# EAGLE design M_J_ext_e_ink_disp-inv (EAGLE 9.6.2)
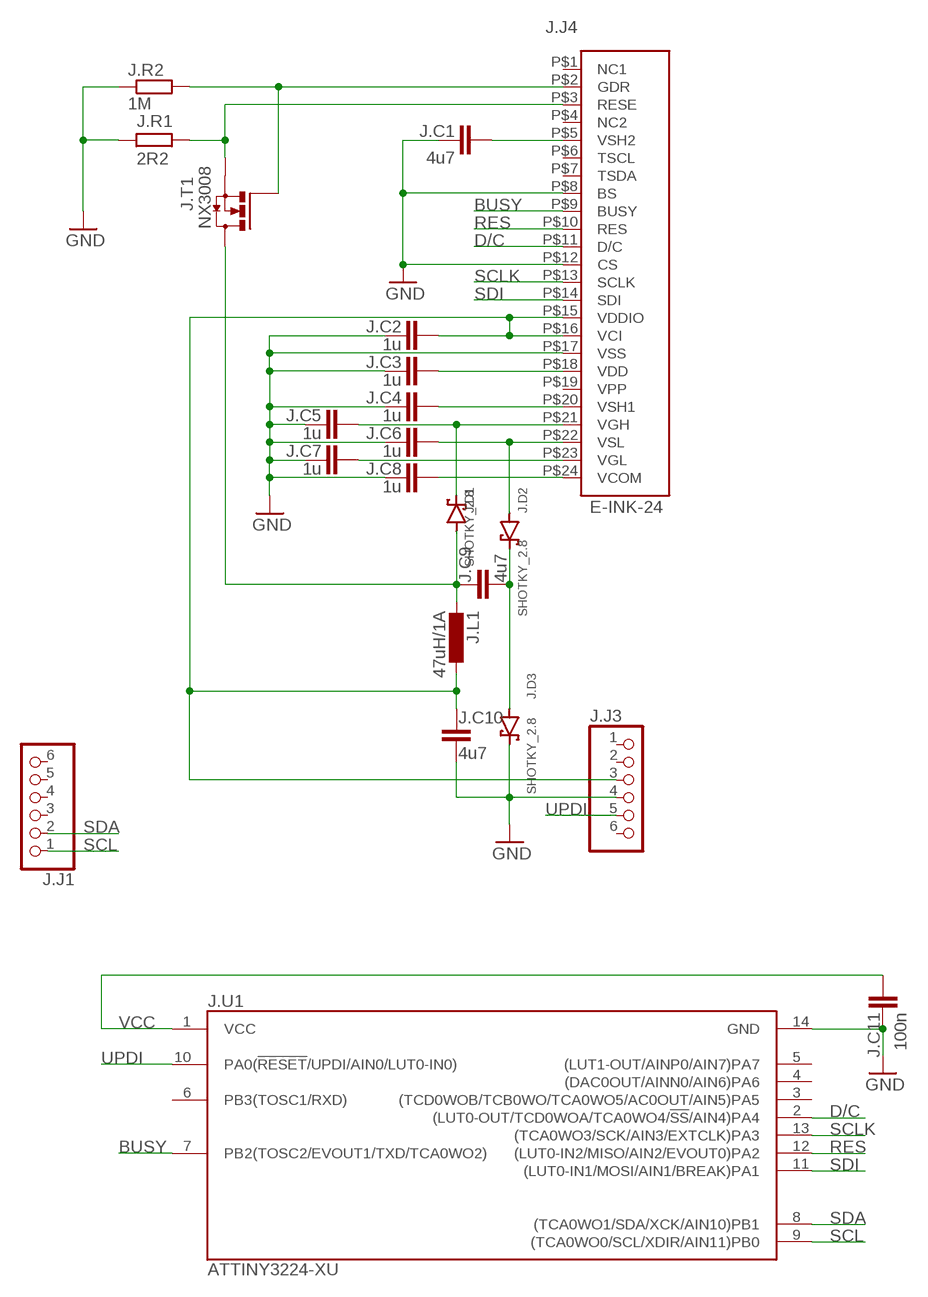
[diagram p0: schematic, sheet 1]

## Parts
J.C1  4u7  C-EUC0603  [C0603]
J.C2  1u  C-EUC0603  [C0603]
J.C3  1u  C-EUC0603  [C0603]
J.C4  1u  C-EUC0603  [C0603]
J.C5  1u  C-EUC0603  [C0603]
J.C6  1u  C-EUC0603  [C0603]
J.C7  1u  C-EUC0603  [C0603]
J.C8  1u  C-EUC0603  [C0603]
J.C9  4u7  C-EUC0603  [C0603]
J.C10  4u7  C-EUC0603  [C0603]
J.C11  100n  C-EUC0603  [C0603]
J.D1  SHOTKY_2.8  [SHOTKY_2.8]
J.D2  SHOTKY_2.8  [SHOTKY_2.8]
J.D3  SHOTKY_2.8  [SHOTKY_2.8]
J.J1  PINHD-1X6  [1X06]
J.J3  PINHD-1X6  [1X06]
J.J4  E-INK-24  [E-INK-24]
J.L1  47uH/1A  L-EUL3230M  [L3230M]
J.R1  2R2  R-EU_R0603  [R0603]
J.R2  1M  R-EU_R0603  [R0603]
J.T1  NX3008  N-MOSFET  [SO23]
J.U1  ATTINY3224-XU  [TSSOP14]

## Nets
BUSY: J.J4.P$9(BUSY) J.U1.7(PB2(TOSC2/EVOUT1/TXD/TCA0WO2))
D/C: J.J4.P$11(D/C) J.U1.2((LUT0-OUT/TCD0WOA/TCA0WO4/!SS!/AIN4)PA4)
GND: J.C1.2 J.C2.2 J.C3.2 J.C4.2 J.C5.2 J.C6.2 J.C7.2 J.C8.2 J.C10.2 J.C11.2 J.D3.K(C) J.J3.4 J.J4.P$8(BS) J.J4.P$12(CS) J.J4.P$17(VSS) J.R1.2 J.R2.1 J.U1.14(GND)
N$1: J.C1.1 J.J4.P$5(VSH2)
N$2: J.C8.1 J.J4.P$24(VCOM)
N$3: J.C6.1 J.D2.A J.J4.P$22(VSL)
N$4: J.C5.1 J.D1.K(C) J.J4.P$21(VGH)
N$5: J.C9.2 J.D2.K(C) J.D3.A
N$6: J.J4.P$3(RESE) J.R1.1 J.T1.S
N$7: J.C3.1 J.J4.P$18(VDD)
N$8: J.C4.1 J.J4.P$20(VSH1)
N$10: J.C9.1 J.D1.A J.L1.2 J.T1.D
N$11: J.C7.1 J.J4.P$23(VGL)
N$13: J.J4.P$2(GDR) J.R2.2 J.T1.G
RES: J.J4.P$10(RES) J.U1.12((LUT0-IN2/MISO/AIN2/EVOUT0)PA2)
SCL: J.J1.1 J.U1.9((TCA0WO0/SCL/XDIR/AIN11)PB0)
SCLK: J.J4.P$13(SCLK) J.U1.13((TCA0WO3/SCK/AIN3/EXTCLK)PA3)
SDA: J.J1.2 J.U1.8((TCA0WO1/SDA/XCK/AIN10)PB1)
SDI: J.J4.P$14(SDI) J.U1.11((LUT0-IN1/MOSI/AIN1/BREAK)PA1)
UPDI: J.J3.5 J.U1.10(PA0(!RESET!/UPDI/AIN0/LUT0-IN0))
VCC: J.C2.1 J.C10.1 J.C11.1 J.J3.3 J.J4.P$15(VDDIO) J.J4.P$16(VCI) J.L1.1 J.U1.1(VCC)
Unconnected: J.J1.3 J.J1.4 J.J1.5 J.J1.6 J.J3.1 J.J3.2 J.J3.6 J.J4.P$1(NC1) J.J4.P$4(NC2) J.J4.P$6(TSCL) J.J4.P$7(TSDA) J.J4.P$19(VPP) J.U1.3((TCD0WOB/TCB0WO/TCA0WO5/AC0OUT/AIN5)PA5) J.U1.4((DAC0OUT/AINN0/AIN6)PA6) J.U1.5((LUT1-OUT/AINP0/AIN7)PA7) J.U1.6(PB3(TOSC1/RXD))

## Library data of the parts
J.C1-J.C11 = rcl:C-EU: CAPACITOR, European symbol; SPICEPREFIX: C
J.D1-J.D3 = hugo:SHOTKY_2.8
J.J1 J.J3 = pinhead2:PINHD-1X6: PIN HEADER
J.J4 = hugo:E-INK-24
J.L1 = rcl:L-EU: INDUCTOR, European symbol; SPICEPREFIX: L
J.R1 = resistor:R-EU_: RESISTOR, European symbol
J.R2 = rcl:R-EU_: RESISTOR, European symbol; SPICEPREFIX: R
J.T1 = hugo:N-MOSFET
J.U1 = ATTINY412-SSN:ATTINY3224-XU

## Board
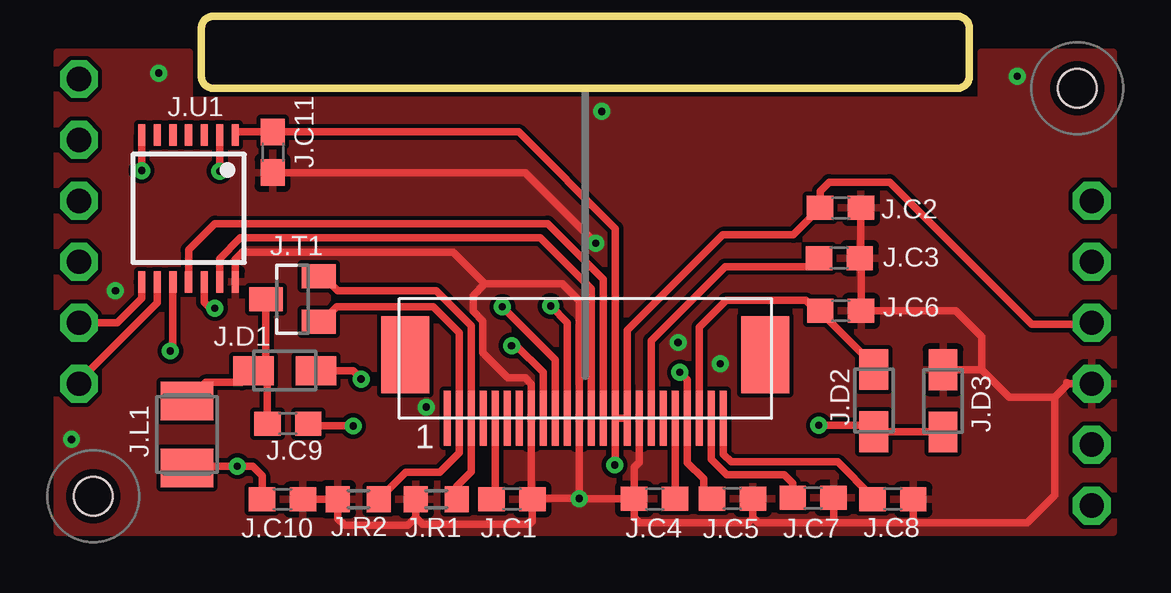
[diagram p1: board, top side]
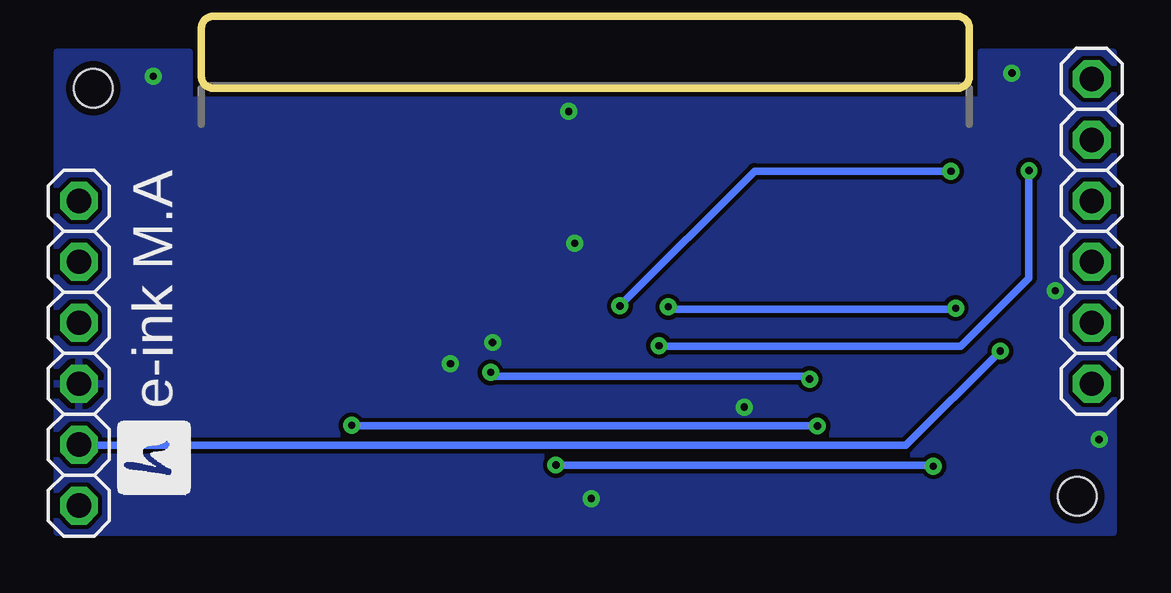
[diagram p2: board, bottom side, seen from below]

No outline drawn. Coordinates in mm, seen from the top.
Copper layers (1*16): Top 0.035mm / dielectric 1.5mm / Bottom 0.035mm
Design rules "default *": minimum track width 10mil, minimum drill 0.3mm, track to track 7mil, track to pad 7mil, pad to pad 7mil, via to via 10mil, smd to smd 10mil, copper to edge 10mil, drill to drill 15mil, minimum pad ring 10mil, minimum via ring 8mil, stop-mask expansion 4mil, vias tented up to drill 0mil, thermal gap 10mil
Holes 1.6 mm at 2,2 43,19
tRestrict: area 1,1 to 3,3; area 42,18 to 44,20
bRestrict: area 42,18 to 44,20; area 1,1 to 3,3
Milling: 8 lines

### Footprints (pad centres in the part's own frame; a part is rotated, then mirrored left to right if it is on the bottom)
C0603 = smd 1.1 x 1: 1 -0.85,0; 2 0.85,0
SHOTKY_2.8 = smd 1.7 x 1.2: A -1.3,0; K 1.3,0
1X06 = drill 1.016 pad 1.575 octagon: 1 -6.35,0; 2 -3.81,0; 3 -1.27,0; 4 1.27,0; 5 3.81,0; 6 6.35,0
E-INK-24 = smd 0.3 x 2.3: P$1 5.75,2.75; P$2 5.25,2.75; P$3 4.75,2.75; P$4 4.25,2.75; P$5 3.75,2.75; P$6 3.25,2.75; P$7 2.75,2.75; P$8 2.25,2.75; P$9 1.75,2.75; P$10 1.25,2.75; P$11 0.75,2.75; P$12 0.25,2.75; P$13 -0.25,2.75; P$14 -0.75,2.75; P$15 -1.25,2.75; P$16 -1.75,2.75; P$17 -2.25,2.75; P$18 -2.75,2.75; P$19 -3.25,2.75; P$20 -3.75,2.75; P$21 -4.25,2.75; P$22 -4.75,2.75; P$23 -5.25,2.75; P$24 -5.75,2.75 | smd 2 x 3.2: P$25 -7.5,0.1; P$26 7.5,0.1
L3230M = smd 1.6 x 2.2: 1 -1.4,0; 2 1.4,0
R0603 = smd 1 x 1.1: 1 -0.85,0; 2 0.85,0
SO23 = smd 1 x 1.4: D 0,1.1; G -0.95,-1.1; S 0.95,-1.1
TSSOP14 = smd 0.3 x 0.9: 1 -1.95,-3.06; 2 -1.3,-3.06; 3 -0.65,-3.06; 4 0,-3.06; 5 0.65,-3.06; 6 1.3,-3.06; 7 1.95,-3.06; 8 1.95,3.06; 9 1.3,3.06; 10 0.65,3.06; 11 0,3.06; 12 -0.65,3.06; 13 -1.3,3.06; 14 -1.95,3.06

### Placement (x,y rotation side)
J.C1  19.45,1.87 0 top
J.C2  33.14,14.01 0 top
J.C3  33.09,11.92 0 top
J.C4  25.39,1.89 180 top
J.C5  28.63,1.9 0 top
J.C6  33.14,9.72 0 top
J.C7  32,1.93 0 top
J.C8  35.32,1.87 0 top
J.C9  10.11,5.02 0 top
J.C10  9.88,1.87 0 top
J.C11  9.47,16.33 270 top
J.D1  9.98,7.23 0 top
J.D2  34.52,5.98 270 top
J.D3  37.41,5.97 90 top
J.J1  1.4,13.04 90 bottom
J.J3  43.6,7.96 270 bottom
J.J4  22.5,8 180 top
J.L1  5.9,4.58 90 top
J.R1  16.29,1.87 180 top
J.R2  13.05,1.87 0 top
J.T1  10.29,10.21 90 top
J.U1  5.97,14 180 top

### Tracks (layer width: path | path; a pad name or v marks a point on that pad's centre or on a via)
BUSY  (via drill 0.3)
  Top 0.305: J.J4.P$9 20.75,7.16 19.63,8.28 v19.43,8.28 | v4.01,15.57 v4.02,15.58 J.U1.7
  Bottom 0.305: v19.43,8.28 19.4,8.28 19.38,8.25 6.86,8.25 4.01,11.09 v4.01,15.57
D/C  (via drill 0.3)
  Top 0.305: J.J4.P$11 21.75,9.24 v21.06,9.93 | v7.26,15.54 v7.27,15.55 J.U1.2
  Bottom 0.305: v21.06,9.93 15.44,15.54 v7.26,15.54
GND  (via drill 0.3)
  Top 0.305: J.J4.P$17 24.74,3.42 24.54,3.21 J.C4.2 | 42.06,6.12 42.06,2.03 40.92,0.89 36.2,0.89 | 42.06,6.12 42.62,6.68 | 42.62,6.68 42.63,6.69 J.J3.4 | J.U1.14 7.92,11.88 8.2,12.17 16.99,12.17 18.31,10.85 | 18.31,10.85 17.83,10.36 17.83,9.7 18.23,9.3 18.23,7.98 19.28,6.93 19.99,6.93 20.25,6.67 J.J4.P$8 20.25,1.92 | 18.31,10.85 21.55,10.85 22.25,10.14 J.J4.P$12 22.25,2.13 | J.C11.2 20,15.48 v22.94,12.55 | J.C10.2 J.R2.1 12.2,1.06 12.47,0.79 15.11,0.79 15.44,1.12 | 20.25,1.92 J.C1.2 20.3,0.97 20.17,0.84 15.72,0.84 15.44,1.12 | J.R1.2 15.44,1.12 | J.C4.2 22.49,1.89 22.25,2.13 | J.C5.2 29.48,1.12 | 29.48,1.12 29.48,1.08 29.29,0.89 24.77,0.89 24.54,1.12 J.C4.2 | 29.48,1.12 29.71,0.89 32.84,0.89 | 36.2,0.89 32.84,0.89 | J.C7.2 32.84,0.89 | J.C8.2 36.17,0.92 36.2,0.89 | 42.56,6.73 42.57,6.73 42.62,6.68 | 39.01,7.26 39.01,8.64 37.93,9.72 J.C6.2 33.99,11.87 J.C3.2 33.99,11.97 J.C2.2 | 39.01,7.26 40.16,6.12 42.06,6.12 | J.D3.K 39.01,7.26 | 22.25,2.13 22.04,1.92 20.25,1.92 | 22.25,2.13 v22.25,1.91 | v22.25,1.91
  other vias: 40.5,19.5 4.72,19.63 2.92,10.57 1.09,4.37 28.12,7.52 23.19,18.03 26.37,8.41 15.88,5.71
  pour Top: 44.5,20.5 39,20.5 39,18.5 6,18.5 6,20.5 0.5,20.5 0.5,0.5 44.5,0.5
  pour Bottom: 44.5,20.5 39,20.5 39,18.5 6,18.5 6,20.5 0.5,20.5 0.5,0.5 44.5,0.5
N$1
  Top 0.305: J.J4.P$5 18.75,2.03 J.C1.1
N$2
  Top 0.305: J.J4.P$24 28.25,3.75 28.57,3.43 33.01,3.43 34.47,1.98 J.C8.1
N$3
  Top 0.305: J.J4.P$22 27.25,9.04 28.37,10.16 31.69,10.16 32.14,9.72 J.C6.1 32.28,9.71 34.52,7.46 J.D2.A
N$4  (via drill 0.3)
  Top 0.305: v26.44,7.16 26.75,6.85 J.J4.P$21 26.75,3.4 27.43,2.72 27.43,2.25 J.C5.1 | J.D1.K 12.83,7.23 13.16,6.9 v13.16,6.88
  Bottom 0.305: v26.44,7.16 26.44,7.11 26.33,7 13.27,7 v13.16,6.88
N$5  (via drill 0.3)
  Top 0.305: 32.31,4.95 v32.23,4.95 34.25,4.95 J.D2.K 37.4,4.68 J.D3.A | v12.83,4.93 12.81,4.95 11.03,4.95 J.C9.2
  Bottom 0.305: v32.23,4.95 32.21,4.93 v12.83,4.93
N$6
  Top 0.305: J.T1.S 11.57,11.16 12.18,10.55 16.3,10.55 17.75,9.1 J.J4.P$3 17.76,3.02 17.14,2.41 J.R1.1
N$7
  Top 0.305: J.J4.P$18 25.25,8.48 28.33,11.56 31.88,11.56 J.C3.1
N$8
  Top 0.305: J.C4.1 26.25,1.9 J.J4.P$20
N$10
  Top 0.305: 5.87,6.11 J.L1.2 6.68,6.75 8.19,6.75 J.D1.A | J.D1.A 9.26,6.81 J.C9.1 | J.D1.A 9.19,7.23 J.T1.D
N$11
  Top 0.305: J.J4.P$23 27.74,3.54 28.39,2.9 30.79,2.9 31.14,2.54 J.C7.1
N$13
  Top 0.305: J.T1.G 11.5,9.26 12.14,9.91 16.15,9.91 17.25,8.81 J.J4.P$2 17.26,3.82 16.43,3 15.02,3 J.R2.2
RES  (via drill 0.3)
  Top 0.305: v19.04,9.89 21.25,7.68 J.J4.P$10 | J.U1.12 6.62,10.08 6.86,9.84 v7.07,9.84
  Bottom 0.305: v7.07,9.84 7.11,9.79 18.94,9.79 v19.04,9.89
SCL
  Top 0.305: J.J1.1 1.4,6.79 4.67,10.06 J.U1.9
SCLK
  Top 0.305: J.J4.P$13 22.75,10.65 20.62,12.78 8.13,12.78 7.26,11.9 J.U1.13
SDA
  Top 0.305: J.U1.8 4.01,10.93 4.01,10.24 3,9.23 J.J1.2
SDI
  Top 0.305: J.J4.P$14 23.25,11.04 20.93,13.36 7.06,13.36 5.97,12.27 J.U1.11
UPDI  (via drill 0.3)
  Top 0.305: v5.21,8.05 5.32,8.16 J.U1.10
  Bottom 0.305: J.J3.5 43.57,4.12 9.14,4.12 v5.21,8.05
VCC  (via drill 0.3)
  Top 0.305: J.J4.P$15 J.J4.P$16 24.25,8.91 28.24,12.89 31.17,12.89 J.C2.1 32.29,14.71 32.66,15.09 35.18,15.09 41.1,9.17 43.54,9.17 J.J3.3 | J.J4.P$15 23.75,3.33 v23.72,3.3 | J.L1.1 5.92,3.16 | J.L1.1 6.29,2.8 | J.L1.1 6.04,3.04 | 6.13,3.18 J.L1.1 | 9.05,1.99 J.C10.1 9.03,2.85 8.64,3.25 v8,3.25 5.98,3.25 J.L1.1 | J.J4.P$15 23.75,13.16 19.72,17.18 J.C11.1 8.05,17.18 J.U1.1
  Bottom 0.305: 43.56,9.2 J.J3.3 | v23.72,3.3 8.05,3.3 v8,3.25

### Text on the board
bPlace: e-ink M.A